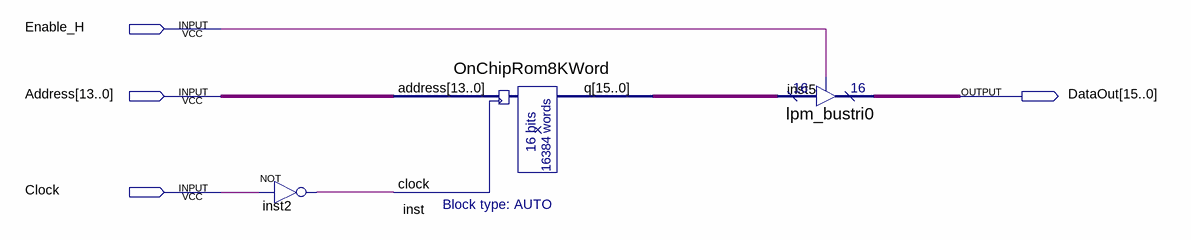
[diagram p0: schematic sheet]
// Quartus schematic OnChipROM16KBytes.bdf as structural Verilog: 3 symbols, 4 pins
module OnChipROM16KBytes (
  input  Enable_H,
  input  [13:0] Address,
  input  Clock,
  output [15:0] DataOut
);

  wire inst2_out;
  wire [15:0] inst_q;

  not inst2 (inst2_out, Clock);
  OnChipRom8KWord inst (.address(Address), .clock(inst2_out), .q(inst_q));
  lpm_bustri0 inst5 (.enabledt(Enable_H), .data(inst_q), .tridata(DataOut));
endmodule
